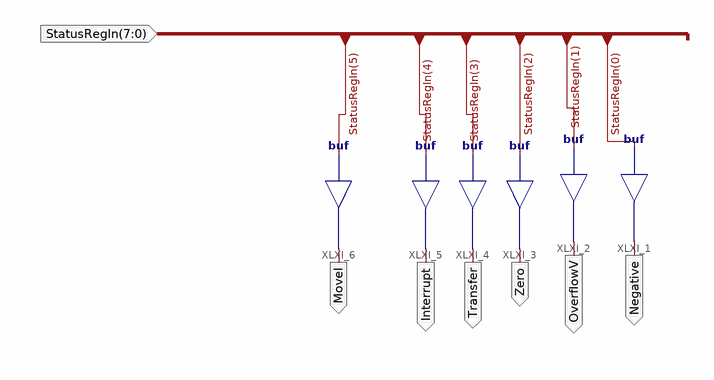
[diagram p0: schematic sheet 1]
// Xilinx ISE schematic StatusRegReader.sch (spartan3e) as structural Verilog: 6 symbols, 7 ports
module StatusRegReader (
  input  [7:0] StatusRegIn,
  output Negative,
  output OverflowV,
  output Zero,
  output Transfer,
  output Interrupt,
  output MoveI
);

  buf XLXI_1 (Negative, StatusRegIn[0]);
  buf XLXI_2 (OverflowV, StatusRegIn[1]);
  buf XLXI_3 (Zero, StatusRegIn[2]);
  buf XLXI_4 (Transfer, StatusRegIn[3]);
  buf XLXI_5 (Interrupt, StatusRegIn[4]);
  buf XLXI_6 (MoveI, StatusRegIn[5]);
endmodule
